# Altium schematic sheet PIX_SH_V3D.SchDoc: CUAV PIXHACK_V3.3
size A1
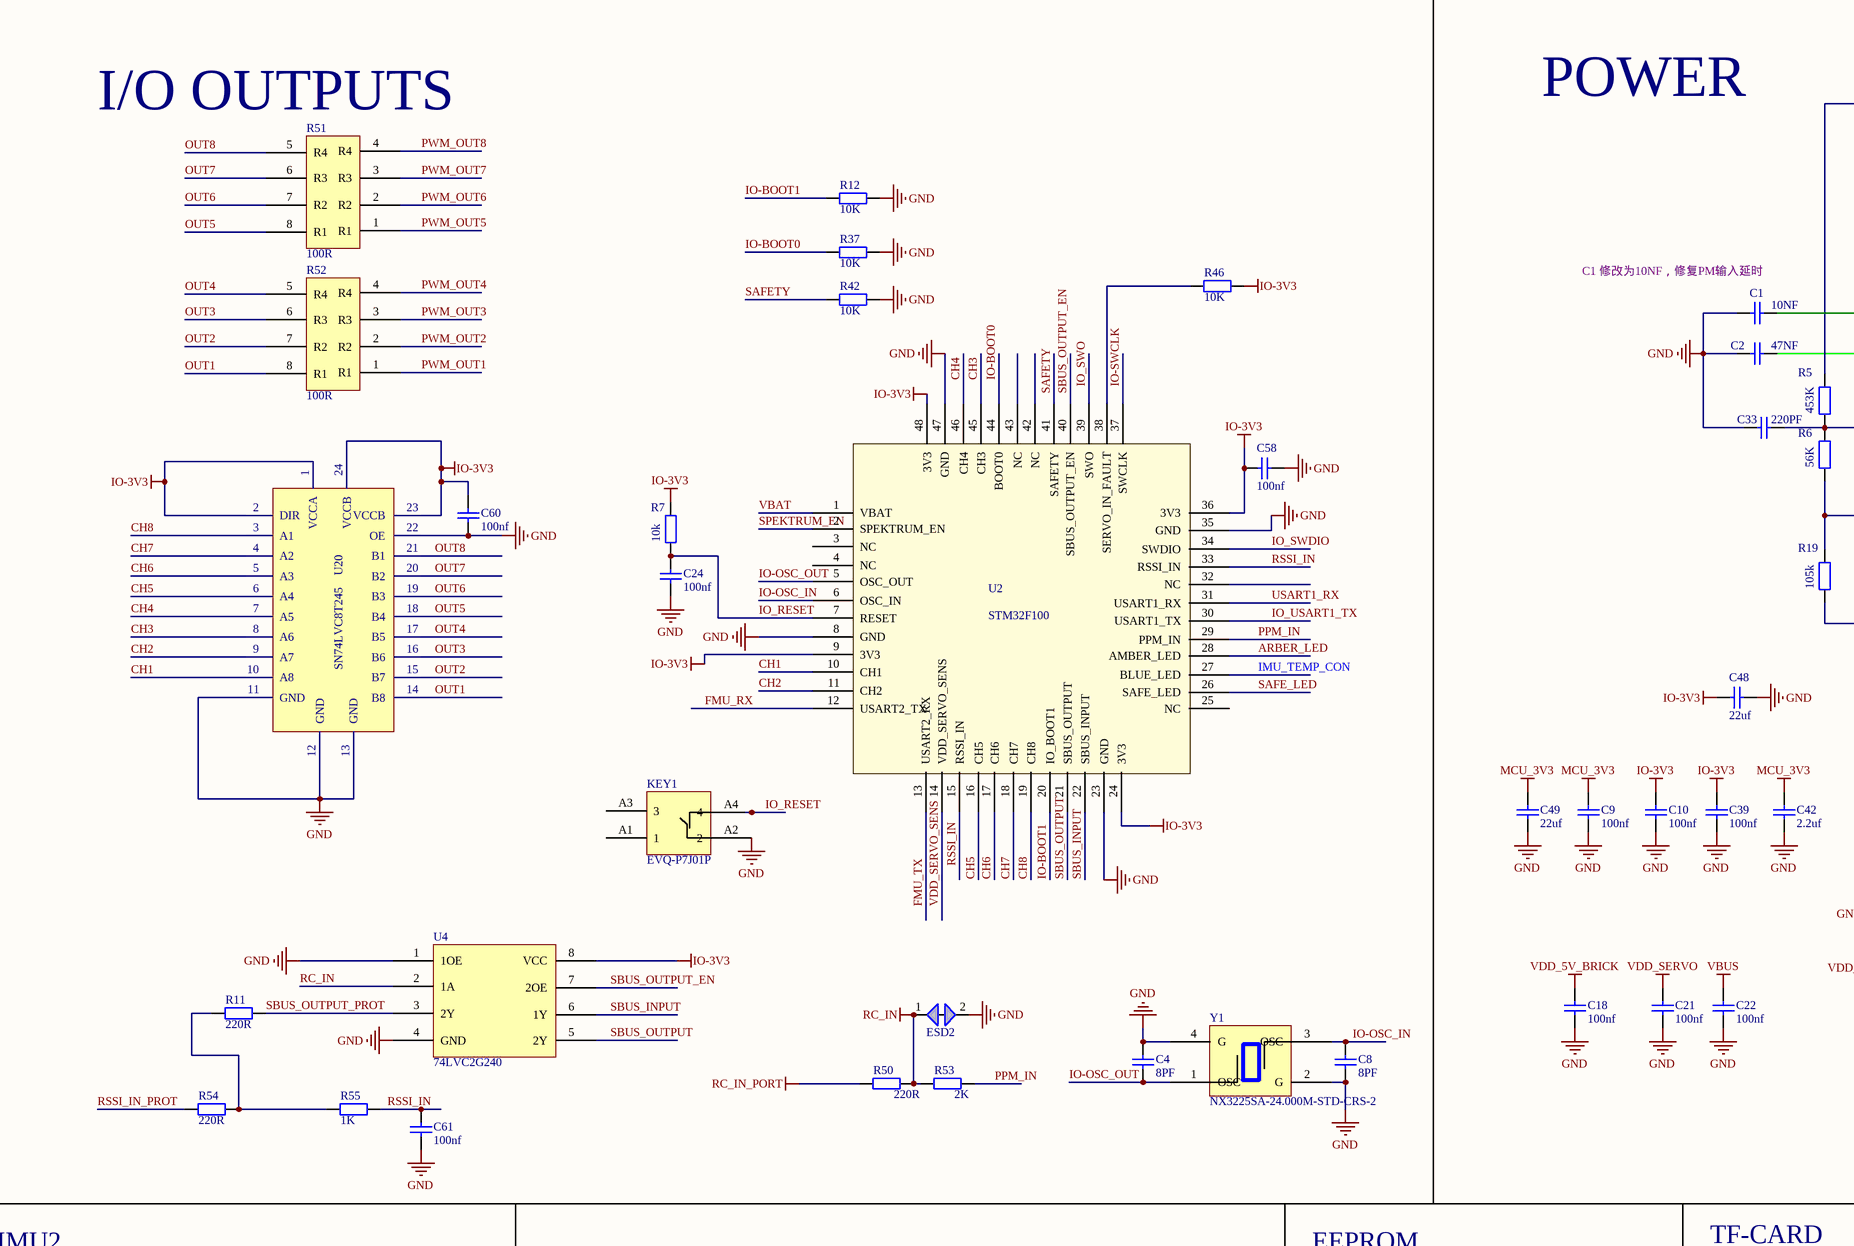
[diagram p0: PIX_SH_V3D.SchDoc, top left]
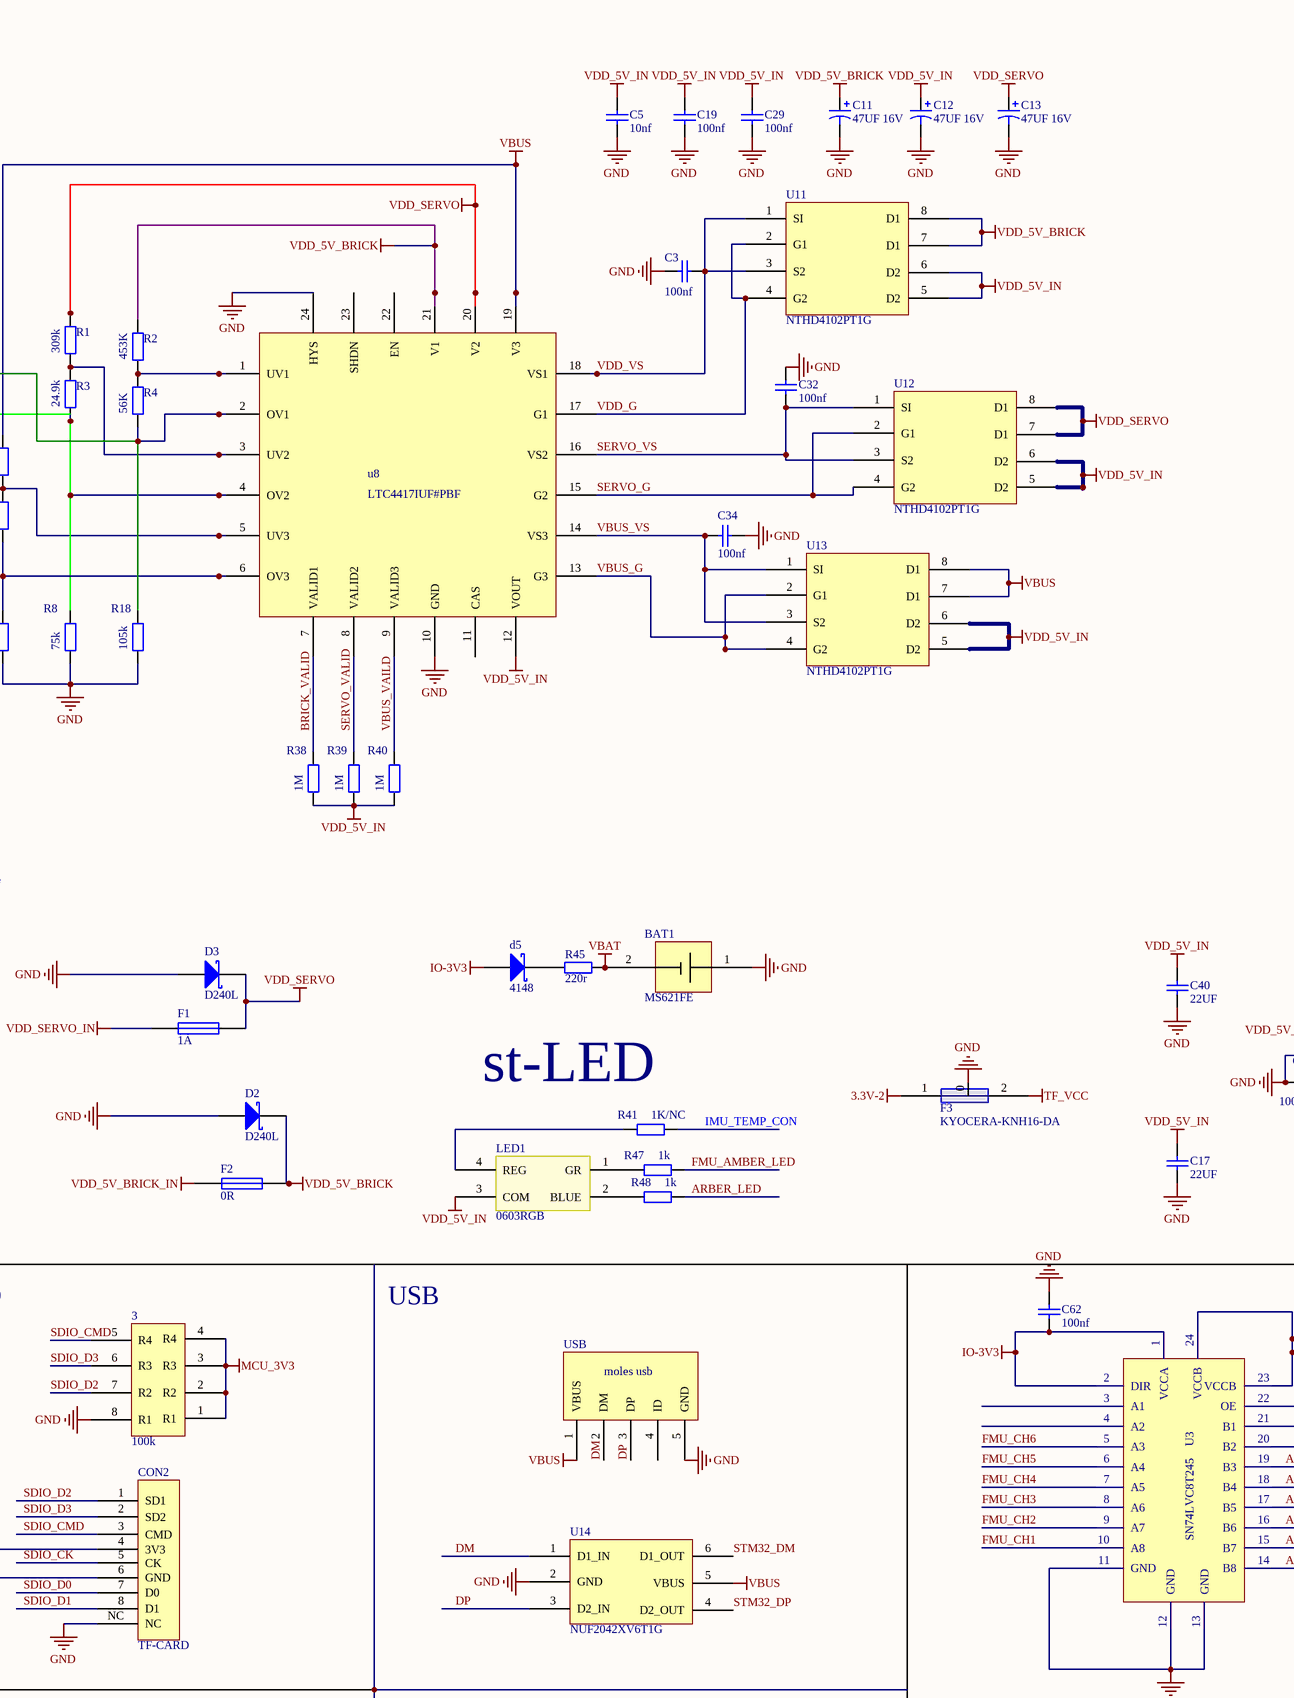
[diagram p1: PIX_SH_V3D.SchDoc, top middle]
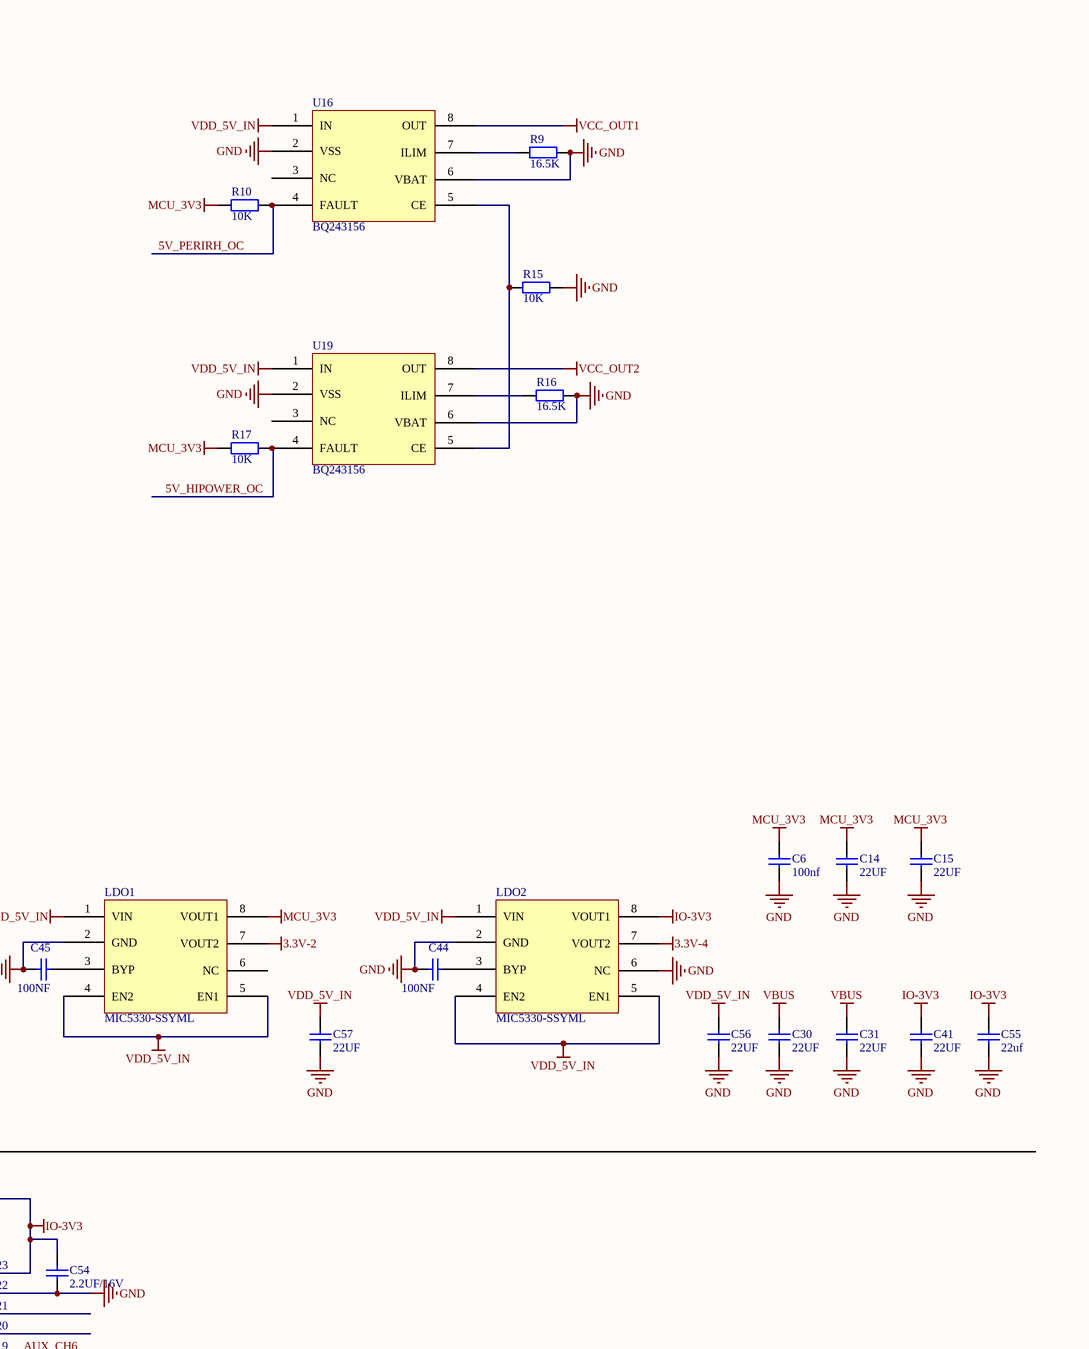
[diagram p2: PIX_SH_V3D.SchDoc, top right]
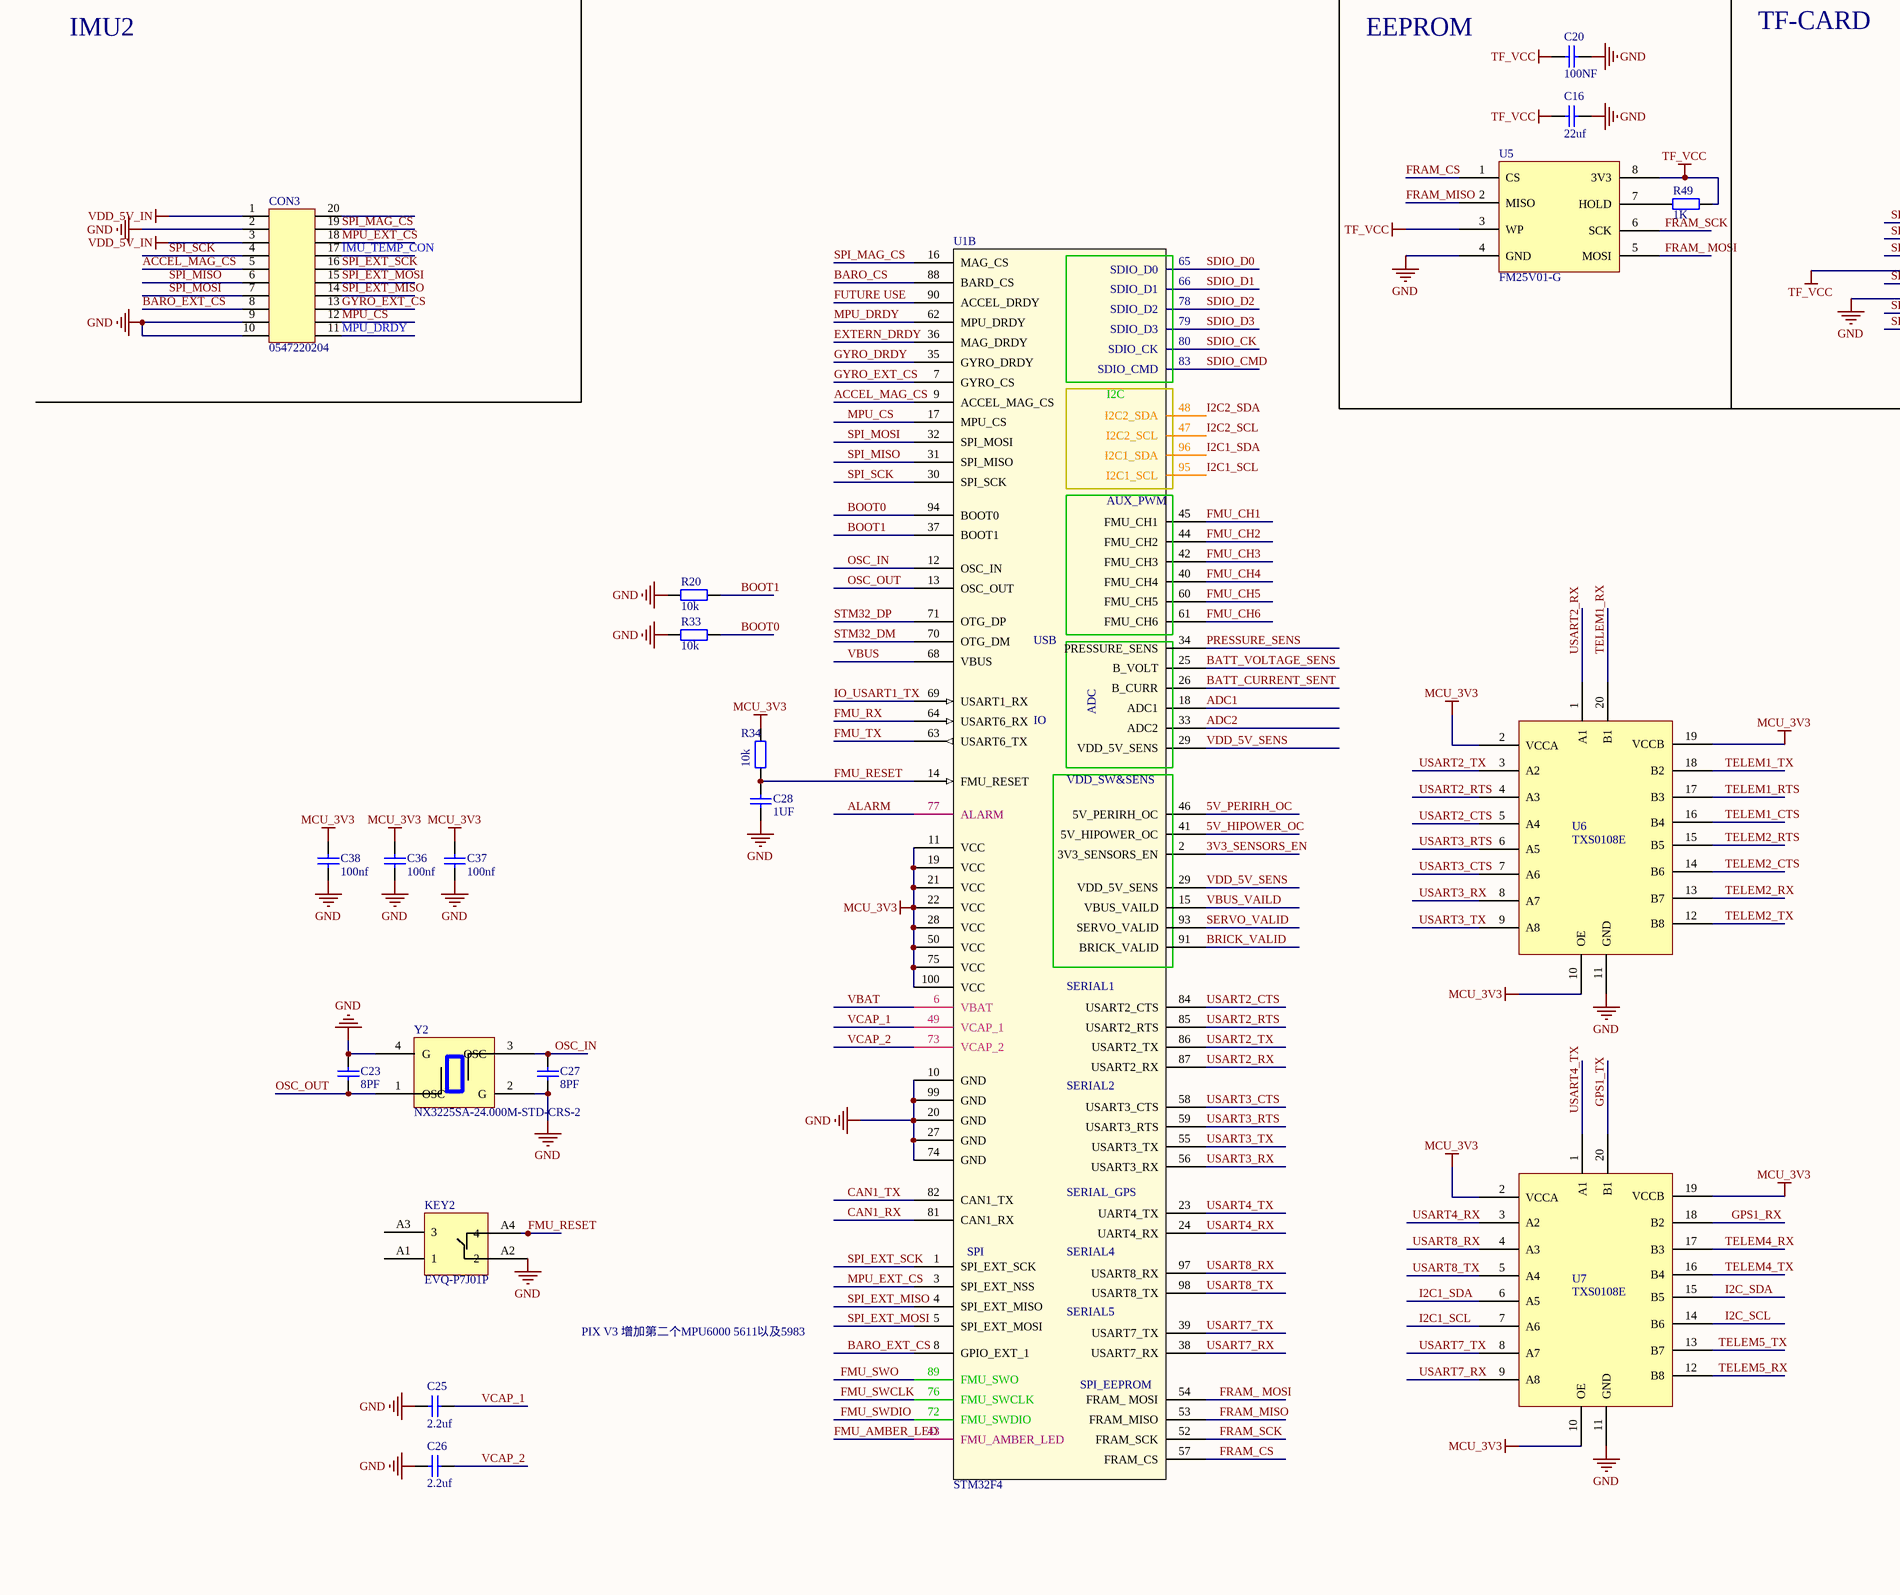
[diagram p3: PIX_SH_V3D.SchDoc, bottom left]
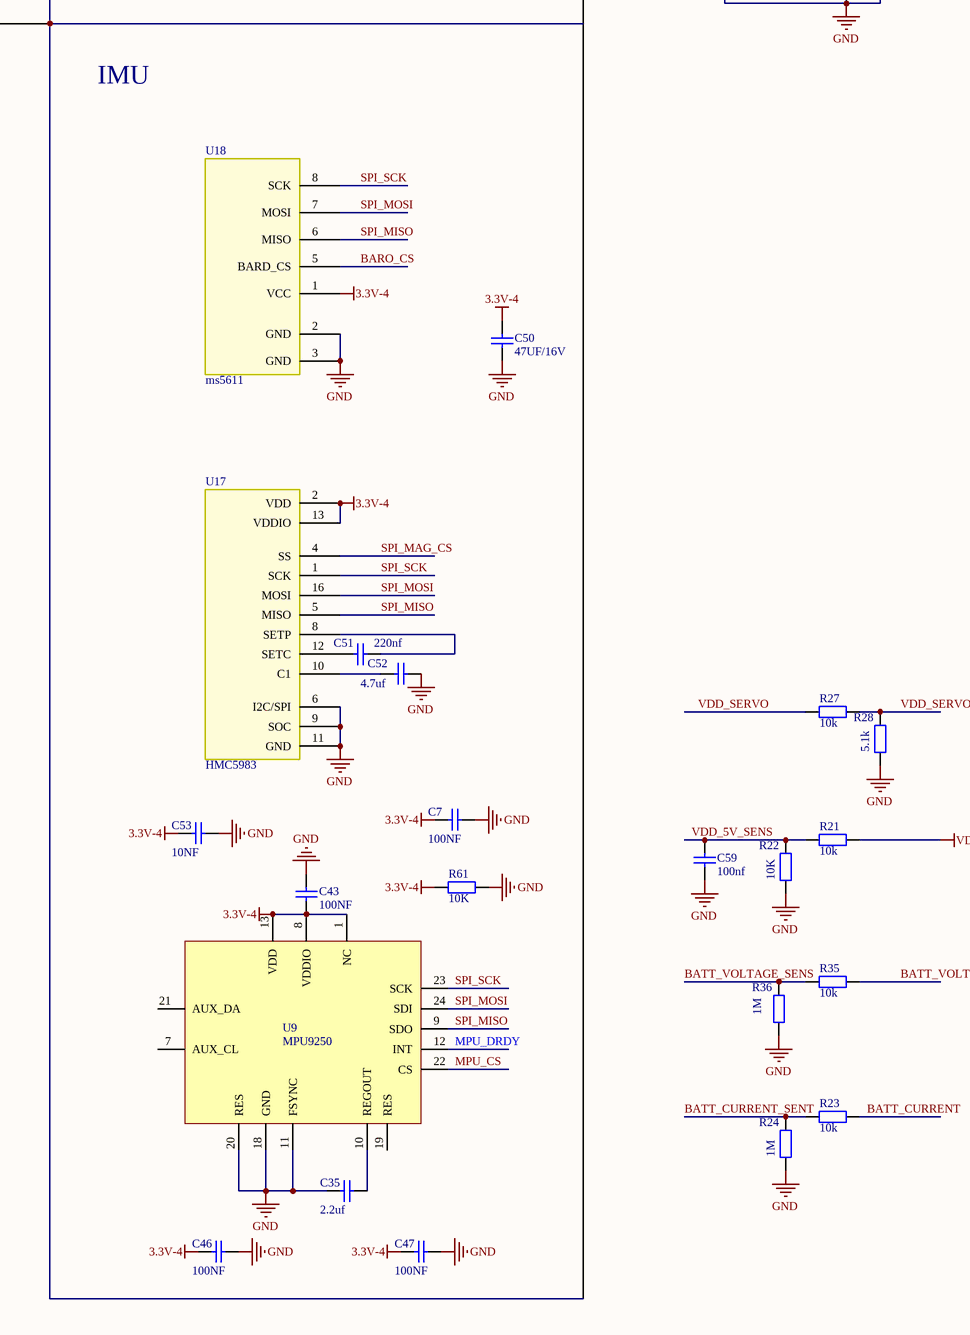
[diagram p4: PIX_SH_V3D.SchDoc, bottom middle]
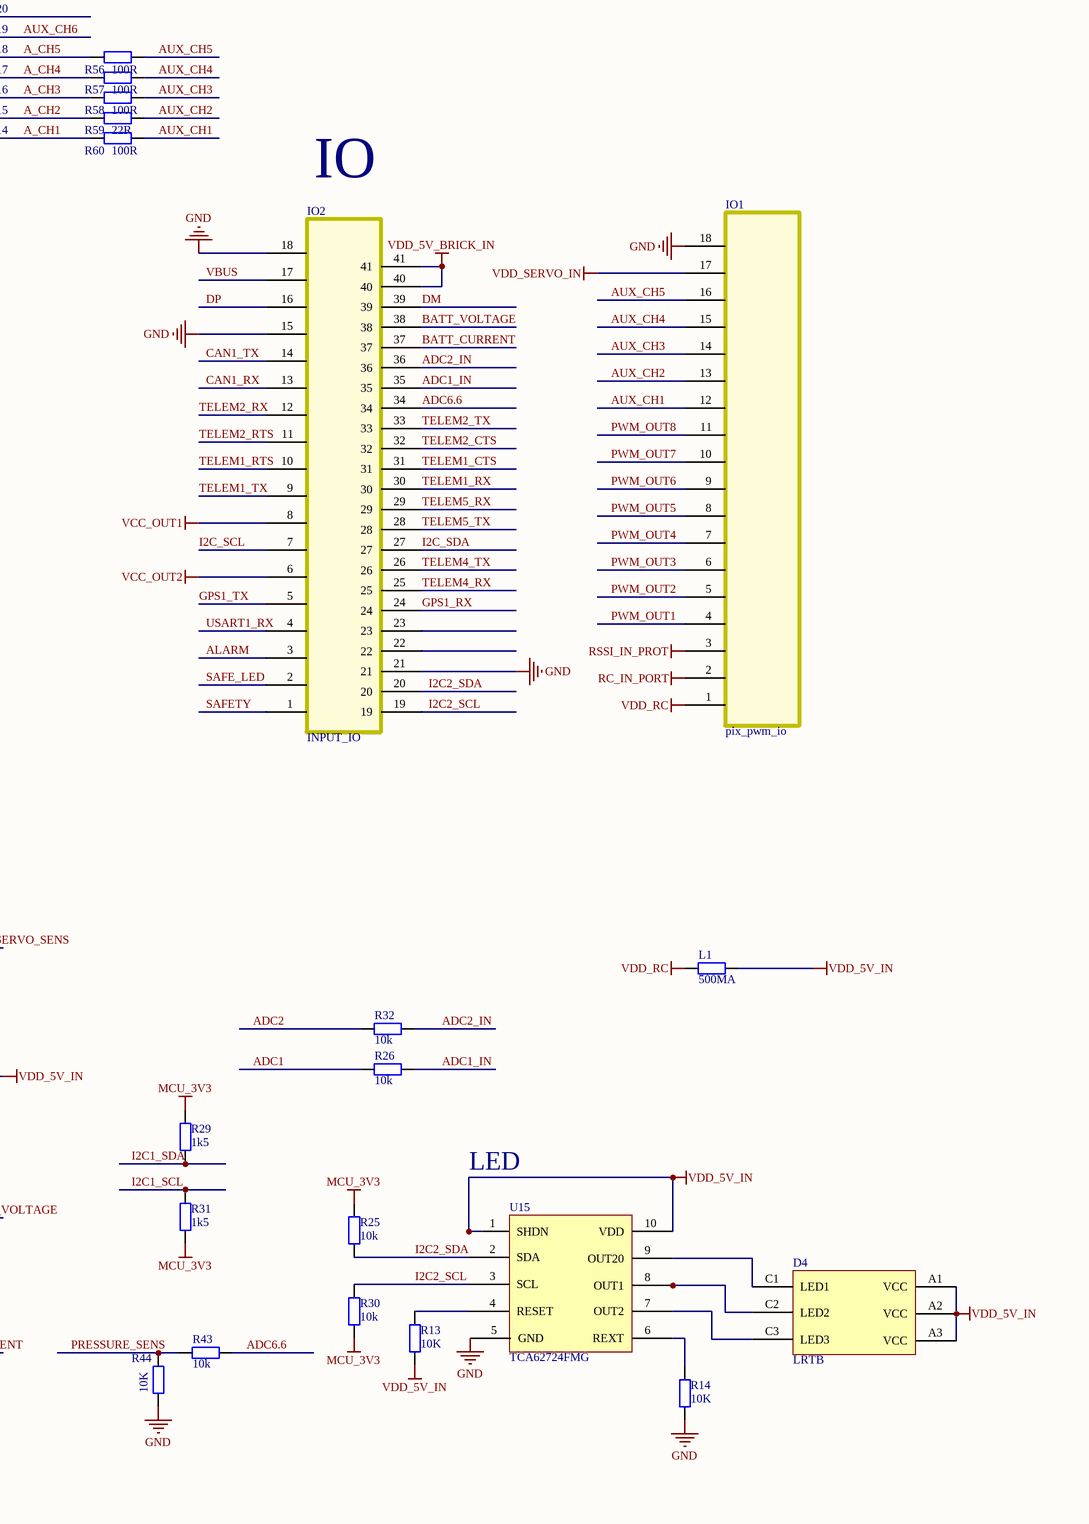
[diagram p5: PIX_SH_V3D.SchDoc, bottom right]

## Parts
3  100k  [0402_4R]
BAT1  MS621FE  [MS621FE]
C1  10NF  [0402CAP]
C2  47NF  [0402CAP]
C3  100nf  [0402CAP]
C4  8PF  [0402CAP]
C5  10nf  [0402CAP]
C6  100nf  [0402CAP]
C7  100NF  [0402CAP]
C8  8PF  [0402CAP]
C9  100nf  [0402CAP]
C10  100nf  [0402CAP]
C11  47UF 16V  [7343CAP]
C12  47UF 16V  [7343CAP]
C13  47UF 16V  [7343CAP]
C14  22UF  [0805CAP]
C15  22UF  [0805CAP]
C16  22uf  [0805cap]
C17  22UF  [0805CAP]
C18  100nf  [0402CAP]
C19  100nf  [0402CAP]
C20  100NF  [0402CAP]
C21  100nf  [0402CAP]
C22  100nf  [0402CAP]
C23  8PF  [0402CAP]
C24  100nf  [0402CAP]
C25  2.2uf  [0402CAP]
C26  2.2uf  [0402CAP]
C27  8PF  [0402CAP]
C28  1UF  [0402CAP]
C29  100nf  [0402CAP]
C30  22UF  [0805CAP]
C31  22UF  [0805CAP]
C32  100nf  [0402CAP]
C33  220PF  [0402CAP]
C34  100nf  [0402CAP]
C35  2.2uf  [0402CAP]
C36  100nf  [0402CAP]
C37  100nf  [0402CAP]
C38  100nf  [0402CAP]
C39  100nf  [0402CAP]
C40  22UF  [0805CAP]
C41  22UF  [0805CAP]
C42  2.2uf  [0402CAP]
C43  100NF  [0402CAP]
C44  100NF  [0402CAP]
C45  100NF  [0402CAP]
C46  100NF  [0402CAP]
C47  100NF  [0402CAP]
C48  22uf  [0805cap]
C49  22uf  [0805cap]
C50  47UF/16V  [c1206a]
C51  220nf  [0402CAP]
C52  4.7uf  [0805cap]
C53  10NF  [0402CAP]
C54  2.2UF/16V  [0402CAP]
C55  22uf  [c1206a]
C56  22UF  [0805CAP]
C57  22UF  [0805CAP]
C58  100nf  [0402CAP]
C59  100nf  [0402CAP]
C60  100nf  [0402CAP]
C61  100nf  [0402CAP]
C62  100nf  [0402CAP]
CON2  TF-CARD  [47352-1001]
CON3  0547220204  [0547220204]
D2  D240L  [SOD-123]
D3  D240L  [SOD-123]
D4  LRTB  [LRTB]
d5  4148  [SOD323]
ESD2  DNP  [ESD0402]  (value not drawn)
F1  1A  [0805L]
F2  0R  [0805L]
F3  KYOCERA-KNH16-DA  [KYOCERA-KNH16-DA]
IO1  pix_pwm_io  [pix_pwm_out]
IO2  INPUT_IO  [PIX_OP]
KEY1  EVQ-P7J01P  [EVQ-P7J01P]
KEY2  EVQ-P7J01P  [EVQ-P7J01P]
L1  500MA  [0805L]
LDO1  MIC5330-SSYML  [MIC5530]
LDO2  MIC5330-SSYML  [MIC5530]
LED1  0603RGB  [0603RGB]
R1  309k  [R0402]
R2  453K  [R0402]
R3  24.9k  [R0402]
R4  56K  [R0402]
R5  453K  [R0402]
R6  56K  [R0402]
R7  10k  [R0402]
R8  75k  [R0402]
R9  16.5K  [R0402]
R10  10K  [R0402]
R11  220R  [R0402]
R12  10K  [R0402]
R13  10K  [R0402]
R14  10K  [R0402]
R15  10K  [R0402]
R16  16.5K  [R0402]
R17  10K  [R0402]
R18  105k  [R0402]
R19  105k  [R0402]
R20  10k  [R0402]
R21  10k  [R0402]
R22  10K  [R0402]
R23  10k  [R0402]
R24  1M  [R0402]
R25  10k  [R0402]
R26  10k  [R0402]
R27  10k  [R0402]
R28  5.1k  [R0402]
R29  1k5  [R0402]
R30  10k  [R0402]
R31  1k5  [R0402]
R32  10k  [R0402]
R33  10k  [R0402]
R34  10k  [R0402]
R35  10k  [R0402]
R36  1M  [R0402]
R37  10K  [R0402]
R38  1M  [R0402]
R39  1M  [R0402]
R40  1M  [R0402]
R41  1K/NC  [R0402]
R42  10K  [R0402]
R43  10k  [R0402]
R44  10K  [R0402]
R45  220r  [R0402]
R46  10K  [R0402]
R47  1k  [R0402]
R48  1k  [R0402]
R49  1K  [R0402]
R50  220R  [R0402]
R51  100R  [0402_4R]
R52  100R  [0402_4R]
R53  2K  [R0402]
R54  220R  [R0402]
R55  1K  [R0402]
R56  100R  [R0402]
R57  100R  [R0402]
R58  100R  [R0402]
R59  22R  [R0402]
R60  100R  [R0402]
R61  10K  [R0402]
U1  STM32F4  [TQFP100_2]  (part B of 2)
U2  STM32F100  [TQFP48]
U3  SN74LVC8T245  [QFN24-RGY]
U4  74LVC2G240  [TSSOP8 - duplicate]
U5  FM25V01-G  [SO-8]
U6  TXS0108E  [QFN20-RGY]
U7  TXS0108E  [QFN20-RGY]
u8  LTC4417IUF#PBF  [QFN24]
U9  MPU9250  [QFN24-0.4]
U11  NTHD4102PT1G  [1206A?03]
U12  NTHD4102PT1G  [1206A?03]
U13  NTHD4102PT1G  [1206A?03]
U14  NUF2042XV6T1G  [SOT563-6]
U15  TCA62724FMG  [SON10]
U16  BQ243156  [QFN8]
U17  HMC5983  [HMC5983]
U18  ms5611  [ms5611]
U19  BQ243156  [QFN8]
U20  SN74LVC8T245  [QFN24-RGY]
USB  moles usb  [moles usb]
Y1  NX3225SA-24.000M-STD-CRS-2  [TSX-3225]
Y2  NX3225SA-24.000M-STD-CRS-2  [TSX-3225]

## Nets
3.3V-2: F3.1 LDO1.7(VOUT2)
3.3V-4: C7.1 C43.1 C46.1 C47.1 C50.1 C53.1 LDO2.7(VOUT2) R61.2 U9.1(NC) U9.8(VDDIO) U9.13(VDD) U17.2(VDD) U17.13(VDDIO) U18.1(VCC)
GND: 3.8(R1) BAT1.1(VDD) C1.2 C2.2 C3.2 C4.2 C5.1 C6.1 C7.2 C8.1 C9.1 C10.1 C11.C C12.C C13.C C14.1 C15.1 C16.1 C17.1 C18.1 C19.1 C20.1 C21.1 C22.1 C23.2 C24.1 C25.1 C26.1 C27.1 C28.1 C29.1 C30.1 C31.1 C32.2 C33.2 C34.2 C35.1 C36.1 C37.1 C38.1 C39.1 C40.1 C41.1 C42.1 C43.2 C44.2 C45.2 C46.2 C47.2 C48.1 C49.1 C50.2 C52.2 C53.2 C54.2 C55.2 C56.1 C57.1 C58.1 C59.1 C60.1 C61.1 C62.1 CON2.6(GND) CON2.NC CON3.2 CON3.9 CON3.10 D2.1(A) D3.1(A) ESD2.2 F3.0 IO1.18 IO2.15 IO2.18 IO2.21 KEY1.A2(2) KEY2.A2(2) LDO1.2(GND) LDO2.2(GND) LDO2.6(NC) R8.1 R9.1 R12.1 R14.1 R15.2 R16.2 R18.1 R19.1 R20.2 R22.1 R24.1 R28.1 R33.2 R36.1 R37.1 R42.1 R44.1 R61.1 U1.10(GND) U1.20(GND) U1.27(GND) U1.74(GND) U1.99(GND) U2.8(GND) U2.23(GND) U2.35(GND) U2.47(GND) U3.11(GND) U3.12(GND) U3.13(GND) U3.22(OE) U4.1(1OE) U4.4(GND) U5.4(GND) U6.11(GND) U7.11(GND) u8.10(GND) u8.24(HYS) U9.11(FSYNC) U9.18(GND) U9.20(RES) U14.2(GND) U15.5(GND) U16.2(VSS) U16.6(VBAT) U17.6(I2C/SPI) U17.9(SOC) U17.11(GND) U18.2(GND) U18.3(GND) U19.2(VSS) U19.6(VBAT) U20.11(GND) U20.12(GND) U20.13(GND) U20.22(OE) USB.5(GND) Y1.2(G) Y1.4(G) Y2.2(G) Y2.4(G)
IO-3V3: C10.2 C39.2 C41.2 C48.2 C54.1 C55.1 C58.2 C60.2 C62.2 d5.1(A) LDO2.8(VOUT1) R7.2 R46.1 U2.9(3V3) U2.24(3V3) U2.36(3V3) U2.48(3V3) U3.1(VCCA) U3.2(DIR) U3.23(VCCB) U3.24(VCCB) U4.8(VCC) U20.1(VCCA) U20.2(DIR) U20.23(VCCB) U20.24(VCCB)
MCU_3V3: 3.1(R1) 3.2(R2) 3.3(R3) 3.4(R4) C6.2 C9.2 C14.2 C15.2 C36.2 C37.2 C38.2 C42.2 C49.2 LDO1.8(VOUT1) R10.1 R17.1 R25.1 R29.1 R30.1 R31.1 R34.2 U1.11(VCC) U1.19(VCC) U1.21(VCC) U1.22(VCC) U1.28(VCC) U1.50(VCC) U1.75(VCC) U1.100(VCC) U6.2(VCCA) U6.10(OE) U6.19(VCCB) U7.2(VCCA) U7.10(OE) U7.19(VCCB)
RC_IN: ESD2.1 R50.2 R53.1 U4.2(1A)
RC_IN_PORT: IO1.2 R50.1
RSSI_IN_PROT: IO1.3 R54.2
TF_VCC: C16.2 C20.2 CON2.4(3V3) F3.2 R49.1 U5.3(WP) U5.8(3V3)
VBAT: BAT1.2(GND) R45.2 U1.6(VBAT) U2.1(VBAT)
VBUS: C22.2 C30.2 C31.2 IO2.17 R5.2 U1.68(VBUS) u8.19(V3) U13.7(D1) U13.8(D1) U14.5(VBUS) USB.1(VBUS)
VCC_OUT1: IO2.8 U16.8(OUT)
VCC_OUT2: IO2.6 U19.8(OUT)
VDD_5V_BRICK: C11.A C18.2 D2.2(K) F2.2 R2.2 u8.21(V1) U11.7(D1) U11.8(D1)
VDD_5V_BRICK_IN: F2.1 IO2.40 IO2.41
VDD_5V_IN: C5.2 C12.A C17.2 C19.2 C29.2 C40.2 C56.2 C57.2 CON3.1 CON3.3 D4.A1(VCC) D4.A2(VCC) D4.A3(VCC) L1.2 LDO1.1(VIN) LDO1.4(EN2) LDO1.5(EN1) LDO2.1(VIN) LDO2.4(EN2) LDO2.5(EN1) LED1.3(COM) R13.1 R21.2 R38.1 R39.1 R40.1 u8.12(VOUT) U11.5(D2) U11.6(D2) U12.5(D2) U12.6(D2) U13.5(D2) U13.6(D2) U15.1(SHDN) U15.10(VDD) U16.1(IN) U19.1(IN)
VDD_RC: IO1.1 L1.1
VDD_SERVO: C13.A C21.2 D3.2(K) F1.1 R1.2 R27.1 u8.20(V2) U12.7(D1) U12.8(D1)
VDD_SERVO_IN: F1.2 IO1.17
3V3_SENSORS_EN: U1.2(3V3_SENSORS_EN)
5V_HIPOWER_OC: R17.2 U1.41(5V_HIPOWER_OC) U19.4(FAULT)
5V_PERIRH_OC: R10.2 U1.46(5V_PERIRH_OC) U16.4(FAULT)
A_CH1: R60.1 U3.14(B8)
A_CH2: R59.1 U3.15(B7)
A_CH3: R58.1 U3.16(B6)
A_CH4: R57.1 U3.17(B5)
A_CH5: R56.1 U3.18(B4)
ACCEL_MAG_CS: CON3.5 U1.9(ACCEL_MAG_CS)
ADC1: R26.1 U1.18(ADC1)
ADC1_IN: IO2.35 R26.2
ADC2: R32.1 U1.33(ADC2)
ADC2_IN: IO2.36 R32.2
ADC6.6: IO2.34 R43.2
ALARM: IO2.3 U1.77(ALARM)
ARBER_LED: R48.2 U2.28(AMBER_LED)
AUX_CH1: IO1.12 R60.2
AUX_CH2: IO1.13 R59.2
AUX_CH3: IO1.14 R58.2
AUX_CH4: IO1.15 R57.2
AUX_CH5: IO1.16 R56.2
AUX_CH6: U3.19(B3)
BARO_CS: U1.88(BARD_CS) U18.5(BARD_CS)
BARO_EXT_CS: CON3.8 U1.8(GPIO_EXT_1)
BATT_CURRENT: IO2.37 R23.2
BATT_CURRENT_SENT: R23.1 R24.2 U1.26(B_CURR)
BATT_VOLTAGE: IO2.38 R35.2
BATT_VOLTAGE_SENS: R35.1 R36.2 U1.25(B_VOLT)
BOOT0: R33.1 U1.94(BOOT0)
BOOT1: R20.1 U1.37(BOOT1)
BRICK_VALID: R38.2 U1.91(BRICK_VALID) u8.7(VALID1)
CAN1_RX: IO2.13 U1.81(CAN1_RX)
CAN1_TX: IO2.14 U1.82(CAN1_TX)
CH1: U2.10(CH1) U20.10(A8)
CH2: U2.11(CH2) U20.9(A7)
CH3: U2.45(CH3) U20.8(A6)
CH4: U2.46(CH4) U20.7(A5)
CH5: U2.16(CH5) U20.6(A4)
CH6: U2.17(CH6) U20.5(A3)
CH7: U2.18(CH7) U20.4(A2)
CH8: U2.19(CH8) U20.3(A1)
DM: IO2.39 U14.1(D1_IN) USB.2(DM)
DP: IO2.16 U14.3(D2_IN) USB.3(DP)
EXTERN_DRDY: U1.36(MAG_DRDY)
FMU_AMBER_LED: R47.2 U1.43(FMU_AMBER_LED)
FMU_CH1: U1.45(FMU_CH1) U3.10(A8)
FMU_CH2: U1.44(FMU_CH2) U3.9(A7)
FMU_CH3: U1.42(FMU_CH3) U3.8(A6)
FMU_CH4: U1.40(FMU_CH4) U3.7(A5)
FMU_CH5: U1.60(FMU_CH5) U3.6(A4)
FMU_CH6: U1.61(FMU_CH6) U3.5(A3)
FMU_RESET: C28.2 KEY2.A4(4) R34.1 U1.14(FMU_RESET)
FMU_RX: U1.64(USART6_RX) U2.12(USART2_TX)
FMU_SWCLK: U1.76(FMU_SWCLK)
FMU_SWDIO: U1.72(FMU_SWDIO)
FMU_SWO: U1.89(FMU_SWO)
FMU_TX: U1.63(USART6_TX) U2.13(USART2_RX)
FRAM_ MOSI: U1.54(FRAM__MOSI) U5.5(MOSI)
FRAM_CS: U1.57(FRAM_CS) U5.1(CS)
FRAM_MISO: U1.53(FRAM_MISO) U5.2(MISO)
FRAM_SCK: U1.52(FRAM_SCK) U5.6(SCK)
FUTURE USE: U1.90(ACCEL_DRDY)
GPS1_RX: IO2.24 U7.18(B2)
GPS1_TX: IO2.5 U7.20(B1)
GYRO_DRDY: U1.35(GYRO_DRDY)
GYRO_EXT_CS: CON3.13 U1.7(GYRO_CS)
I2C1_SCL: R31.2 U1.95(I2C1_SCL) U7.7(A6)
I2C1_SDA: R29.2 U1.96(I2C1_SDA) U7.6(A5)
I2C2_SCL: IO2.19 R30.2 U1.47(I2C2_SCL) U15.3(SCL)
I2C2_SDA: IO2.20 R25.2 U1.48(I2C2_SDA) U15.2(SDA)
I2C_SCL: IO2.7 U7.14(B6)
I2C_SDA: IO2.27 U7.15(B5)
IMU_TEMP_CON: CON3.17 R41.2 U2.27(BLUE_LED)
IO-BOOT0: R37.2 U2.44(BOOT0)
IO-BOOT1: R12.2 U2.20(IO_BOOT1)
IO-OSC_IN: C8.2 U2.6(OSC_IN) Y1.3(OSC)
IO-OSC_OUT: C4.1 U2.5(OSC_OUT) Y1.1(OSC)
IO-SWCLK: U2.37(SWCLK)
IO_RESET: C24.2 KEY1.A4(4) R7.1 U2.7(RESET)
IO_SWDIO: U2.34(SWDIO)
IO_SWO: U2.39(SWO)
IO_USART1_TX: U1.69(USART1_RX) U2.30(USART1_TX)
MPU_CS: CON3.12 U1.17(MPU_CS) U9.22(CS)
MPU_DRDY: CON3.11 U1.62(MPU_DRDY) U9.12(INT)
MPU_EXT_CS: CON3.18 U1.3(SPI_EXT_NSS)
OSC_IN: C27.2 U1.12(OSC_IN) Y2.3(OSC)
OSC_OUT: C23.1 U1.13(OSC_OUT) Y2.1(OSC)
OUT1: R52.8(R1) U20.14(B8)
OUT2: R52.7(R2) U20.15(B7)
OUT3: R52.6(R3) U20.16(B6)
OUT4: R52.5(R4) U20.17(B5)
OUT5: R51.8(R1) U20.18(B4)
OUT6: R51.7(R2) U20.19(B3)
OUT7: R51.6(R3) U20.20(B2)
OUT8: R51.5(R4) U20.21(B1)
PPM_IN: R53.2 U2.29(PPM_IN)
PRESSURE_SENS: R43.1 R44.2 U1.34(PRESSURE_SENS)
PWM_OUT1: IO1.4 R52.1(R1)
PWM_OUT2: IO1.5 R52.2(R2)
PWM_OUT3: IO1.6 R52.3(R3)
PWM_OUT4: IO1.7 R52.4(R4)
PWM_OUT5: IO1.8 R51.1(R1)
PWM_OUT6: IO1.9 R51.2(R2)
PWM_OUT7: IO1.10 R51.3(R3)
PWM_OUT8: IO1.11 R51.4(R4)
RSSI_IN: C61.2 R55.1 U2.15(RSSI_IN) U2.33(RSSI_IN)
SAFE_LED: IO2.2 U2.26(SAFE_LED)
SAFETY: IO2.1 R42.2 U2.41(SAFETY)
SBUS_INPUT: U2.22(SBUS_INPUT) U4.6(1Y)
SBUS_OUTPUT: U2.21(SBUS_OUTPUT) U4.5(2Y)
SBUS_OUTPUT_EN: U2.40(SBUS_OUTPUT_EN) U4.7(2OE)
SBUS_OUTPUT_PROT: R11.1 U4.3(2Y)
SDIO_CK: CON2.5(CK) U1.80(SDIO_CK)
SDIO_CMD: 3.5(R4) CON2.3(CMD) U1.83(SDIO_CMD)
SDIO_D0: CON2.7(D0) U1.65(SDIO_D0)
SDIO_D1: CON2.8(D1) U1.66(SDIO_D1)
SDIO_D2: 3.7(R2) CON2.1(SD1) U1.78(SDIO_D2)
SDIO_D3: 3.6(R3) CON2.2(SD2) U1.79(SDIO_D3)
SERVO_G: u8.15(G2) U12.2(G1) U12.4(G2)
SERVO_VALID: R39.2 U1.93(SERVO_VALID) u8.8(VALID2)
SERVO_VS: C32.1 u8.16(VS2) U12.1(SI) U12.3(S2)
SPEKTRUM_EN: U2.2(SPEKTRUM_EN)
SPI_EXT_MISO: CON3.14 U1.4(SPI_EXT_MISO)
SPI_EXT_MOSI: CON3.15 U1.5(SPI_EXT_MOSI)
SPI_EXT_SCK: CON3.16 U1.1(SPI_EXT_SCK)
SPI_MAG_CS: CON3.19 U1.16(MAG_CS) U17.4(SS)
SPI_MISO: CON3.6 U1.31(SPI_MISO) U9.9(SDO) U17.5(MISO) U18.6(MISO)
SPI_MOSI: CON3.7 U1.32(SPI_MOSI) U9.24(SDI) U17.16(MOSI) U18.7(MOSI)
SPI_SCK: CON3.4 U1.30(SPI_SCK) U9.23(SCK) U17.1(SCK) U18.8(SCK)
STM32_DM: U1.70(OTG_DM) U14.6(D1_OUT)
STM32_DP: U1.71(OTG_DP) U14.4(D2_OUT)
TELEM1_CTS: IO2.31 U6.16(B4)
TELEM1_RTS: IO2.10 U6.17(B3)
TELEM1_RX: IO2.30 U6.20(B1)
TELEM1_TX: IO2.9 U6.18(B2)
TELEM2_CTS: IO2.32 U6.14(B6)
TELEM2_RTS: IO2.11 U6.15(B5)
TELEM2_RX: IO2.12 U6.13(B7)
TELEM2_TX: IO2.33 U6.12(B8)
TELEM4_RX: IO2.25 U7.17(B3)
TELEM4_TX: IO2.26 U7.16(B4)
TELEM5_RX: IO2.29 U7.12(B8)
TELEM5_TX: IO2.28 U7.13(B7)
USART1_RX: IO2.4 U2.31(USART1_RX)
USART2_CTS: U1.84(USART2_CTS) U6.5(A4)
USART2_RTS: U1.85(USART2_RTS) U6.4(A3)
USART2_RX: U1.87(USART2_RX) U6.1(A1)
USART2_TX: U1.86(USART2_TX) U6.3(A2)
USART3_CTS: U1.58(USART3_CTS) U6.7(A6)
USART3_RTS: U1.59(USART3_RTS) U6.6(A5)
USART3_RX: U1.56(USART3_RX) U6.8(A7)
USART3_TX: U1.55(USART3_TX) U6.9(A8)
USART4_RX: U1.24(UART4_RX) U7.3(A2)
USART4_TX: U1.23(UART4_TX) U7.1(A1)
USART7_RX: U1.38(USART7_RX) U7.9(A8)
USART7_TX: U1.39(USART7_TX) U7.8(A7)
USART8_RX: U1.97(USART8_RX) U7.4(A3)
USART8_TX: U1.98(USART8_TX) U7.5(A4)
VBUS_G: u8.13(G3) U13.2(G1) U13.4(G2)
VBUS_VAILD: R40.2 U1.15(VBUS_VAILD) u8.9(VALID3)
VBUS_VS: C34.1 u8.14(VS3) U13.1(SI) U13.3(S2)
VCAP_1: C25.2 U1.49(VCAP_1)
VCAP_2: C26.2 U1.73(VCAP_2)
VDD_5V_SENS: C59.2 R21.1 R22.2 U1.29(VDD_5V_SENS)
VDD_G: u8.17(G1) U11.2(G1) U11.4(G2)
VDD_SERVO_SENS: R27.2 R28.2 U2.14(VDD_SERVO_SENS)
VDD_VS: C3.1 u8.18(VS1) U11.1(SI) U11.3(S2)
NetC1_1: C1.1 R4.1 R18.2 u8.2(OV1)
NetC2_1: C2.1 R3.1 R8.2 u8.4(OV2)
NetC33_1: C33.1 R5.1 R6.2 u8.5(UV3)
NetC35_2: C35.2 U9.10(REGOUT)
NetC44_1: C44.1 LDO2.3(BYP)
NetC45_1: C45.1 LDO1.3(BYP)
NetC51_1: C51.1 U17.12(SETC)
NetC51_2: C51.2 U17.8(SETP)
NetC52_1: C52.1 U17.10(C1)
NetD4_C1: D4.C1(LED1) U15.9(OUT20)
NetD4_C2: D4.C2(LED2) U15.8(OUT1)
NetD4_C3: D4.C3(LED3) U15.7(OUT2)
Netd5_2: d5.2(K) R45.1
NetLED1_1: LED1.1(GR) R47.1
NetLED1_2: LED1.2(BLUE) R48.1
NetLED1_4: LED1.4(REG) R41.1
NetR1_1: R1.1 R3.2 u8.3(UV2)
NetR2_1: R2.1 R4.2 u8.1(UV1)
NetR6_1: R6.1 R19.2 u8.6(OV3)
NetR9_2: R9.2 U16.7(ILIM)
NetR11_2: R11.2 R54.1 R55.2
NetR13_2: R13.2 U15.4(RESET)
NetR14_2: R14.2 U15.6(REXT)
NetR15_1: R15.1 U16.5(CE) U19.5(CE)
NetR16_1: R16.1 U19.7(ILIM)
NetR46_2: R46.2 U2.38(SERVO_IN_FAULT)
NetR49_2: R49.2 U5.7(HOLD)

Not connected (* = marked no-connect by the designer): CON3 20(19); IO2 22 23; KEY1 A1(1) A3(3); KEY2 A1(1) A3(3); LDO1 6(NC); U2 3(NC) 4(NC) 25(NC) 32(NC) 42(NC) 43(NC); U3 3(A1) 4(A2) 20(B2) 21(B1); u8 11(CAS) 22(EN) 23(SHDN); U9 7(AUX_CL) 19(RES) 21(AUX_DA); U16 3(NC); U19 3(NC); USB 4(ID)

## Notes on the sheet
- (near R51) I/O OUTPUTS
- POWER
- C1 修改为10NF，修复PM输入延时
- (near R41) st-LED
- IMU2
- EEPROM
- TF-CARD
- USB
- IO
- IMU
- PIX V3 增加第二个MPU6000 5611以及5983
- LED
- Title
- Size:
- Date:
- File:
- A1
- Number:
- Time:
- Revision:
- Sheet
- of
- (in symbol STM32F4, part B) I2C; AUX_PWM; USB; ADC; IO; VDD_SW&SENS; SERIAL1; SERIAL2; SERIAL_GPS; SPI; SERIAL4; SERIAL5; SPI_EEPROM

## Library data of the parts
3 R51 R52 = 0402_4R
C1-C6 C8-C10 C14-C34 C36-C42 C44 C45 C48-C50 C54-C62 = Cap: Value: 100pF; Published: 8-Jun-2000; LatestRevisionDate: 17-Jul-2002; LatestRevisionNote: Re-released for DXP Platform.; PackageReference: RAD-0.3; Publisher: Altium Limited; PackageDescription: Radial Cap, Thru-Hole; 2 Leads; 0.3 in Pin Spacing
C7 C35 C43 C46 C47 C51-C53 = Cap: Capacitor; Value: 100pF; Published: 8-Jun-2000; LatestRevisionDate: 17-Jul-2002; LatestRevisionNote: Re-released for DXP Platform.; PackageReference: RAD-0.3; Publisher: Altium Limited; PackageDescription: Radial Cap, Thru-Hole; 2 Leads; 0.3 in Pin Spacing
C11-C13 = Cap Pol1: Polarized Capacitor (Radial); Value: 100pF; Published: 8-Jun-2000; LatestRevisionDate: 17-Jul-2002; LatestRevisionNote: Re-released for DXP Platform.; PackageReference: RB7.6-15; Publisher: Altium Limited; PackageDescription: Polarized Capacitor (Radial); 2 Leads
CON2 = 47352-1001
D2 D3 d5 = D Schottky: Schottky Diode; Published: 8-Jun-2000; LatestRevisionDate: 17-Jul-2002; LatestRevisionNote: Re-released for DXP Platform.; PackageReference: SMB; Publisher: Altium Limited; PackageDescription: DO-214-AA/SMB; 2 C-Bend Leads; Body 5.3 x 3.6 mm, inc. leads (LxW); Code_JEDEC: DO-214-AA
ESD2 = ESD0402
F1 F2 = Fuse 1: Fuse; Published: 8-Jun-2000; LatestRevisionDate: 17-Jul-2002; LatestRevisionNote: Re-released for DXP Platform.; PackageReference: PIN-W2/E2.8; Publisher: Altium Limited; PackageDescription: Thru-Hole; 2 Leads
L1 R47-R49 R55 R61 = Res2: Resistor
  R47-R49 R55: Published: 8-Jun-2000; LatestRevisionDate: 17-Jul-2002; LatestRevisionNote: Re-released for DXP Platform.; PackageReference: AXIAL-0.4; Publisher: Altium Limited; PackageDescription: Axial Device, Thru-Hole; 2 Leads; 0.4 in Pin Spacing; Value: 1K
LDO1 LDO2 = MIC5530
R1-R46 R50 R53 R54 R56-R60 = Res2: Resistor; Value: 1K; Published: 8-Jun-2000; LatestRevisionDate: 17-Jul-2002; LatestRevisionNote: Re-released for DXP Platform.; PackageReference: AXIAL-0.4; Publisher: Altium Limited; PackageDescription: Axial Device, Thru-Hole; 2 Leads; 0.4 in Pin Spacing
U5 = Component_1
Y1 Y2 = TSX-3225